# EAGLE design nrf_bridge (EAGLE 6.5.0)
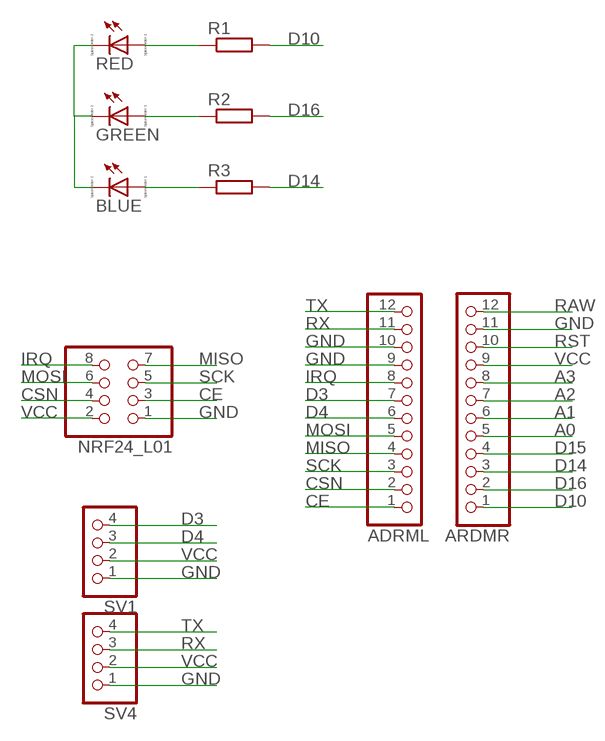
[diagram p0: schematic, sheet 1]

## Parts
ADRML  PINHD-1X12_2.54-SMD  [1X12SMD]
ARDMR  PINHD-1X12_2.54-SMD  [1X12SMD]
BLUE  LED_ESML0603  [LED_SML0603]
GREEN  LED_ESML0603  [LED_SML0603]
NRF24_L01  PINHD-2X4_2.54-SMD  [2X04SMD]
R1  R-EU_M0805  [M0805]
R2  R-EU_M0805  [M0805]
R3  R-EU_M0805  [M0805]
RED  LED_ESML0603  [LED_SML0603]
SV1  PINHD-1X4_2.54-SMD  [1X04SMD]
SV4  PINHD-1X4_2.54-SMD  [1X04SMD]

## Nets
A0: ARDMR.5
A1: ARDMR.6
A2: ARDMR.7
A3: ARDMR.8
CE: ADRML.1 NRF24_L01.3
CSN: ADRML.2 NRF24_L01.4
D3: ADRML.7 SV1.4
D4: ADRML.6 SV1.3
D10: ARDMR.1 R1.2
D14: ARDMR.3 R3.2
D15: ARDMR.4
D16: ARDMR.2 R2.2
GND: ADRML.9 ADRML.10 ARDMR.11 BLUE.C GREEN.C NRF24_L01.1 RED.C SV1.1 SV4.1
IRQ: ADRML.8 NRF24_L01.8
MISO: ADRML.4 NRF24_L01.7
MOSI: ADRML.5 NRF24_L01.6
N$1: BLUE.A R3.1
N$2: GREEN.A R2.1
N$3: R1.1 RED.A
RAW: ARDMR.12
RST: ARDMR.10
RX: ADRML.11 SV4.3
SCK: ADRML.3 NRF24_L01.5
TX: ADRML.12 SV4.4
VCC: ARDMR.9 NRF24_L01.2 SV1.2 SV4.2

## Library data of the parts
ADRML ARDMR = pinhead_smd:PINHD-1X12: PIN HEADER
BLUE GREEN RED = eagle-ltspice:LED_E: LED Source: http://www.osram.convergy.de Source: www.luxeon.com Source: www.kingbright.com; SPICEMODEL: NONE; SPICEPREFIX: D; SPICETYPE: diode
NRF24_L01 = pinhead_smd:PINHD-2X4: PIN HEADER
R1-R3 = resistor:R-EU_: RESISTOR, European symbol
SV1 SV4 = pinhead_smd:PINHD-1X4: PIN HEADER

## Board
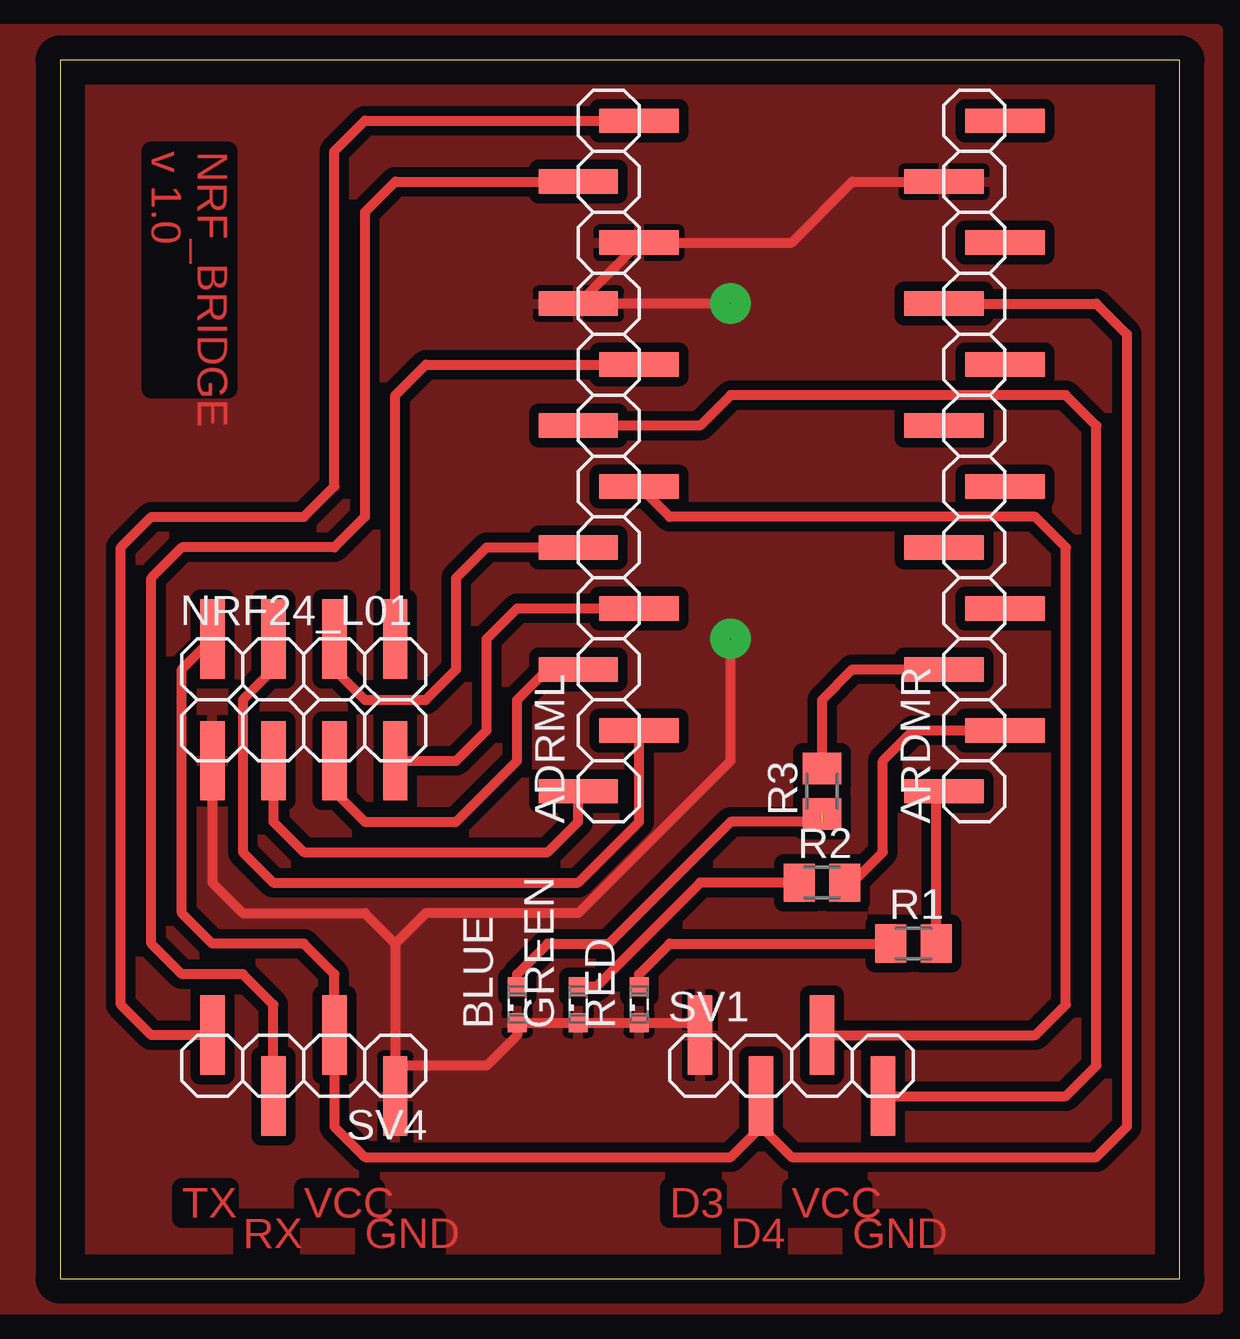
[diagram p1: board, top side]
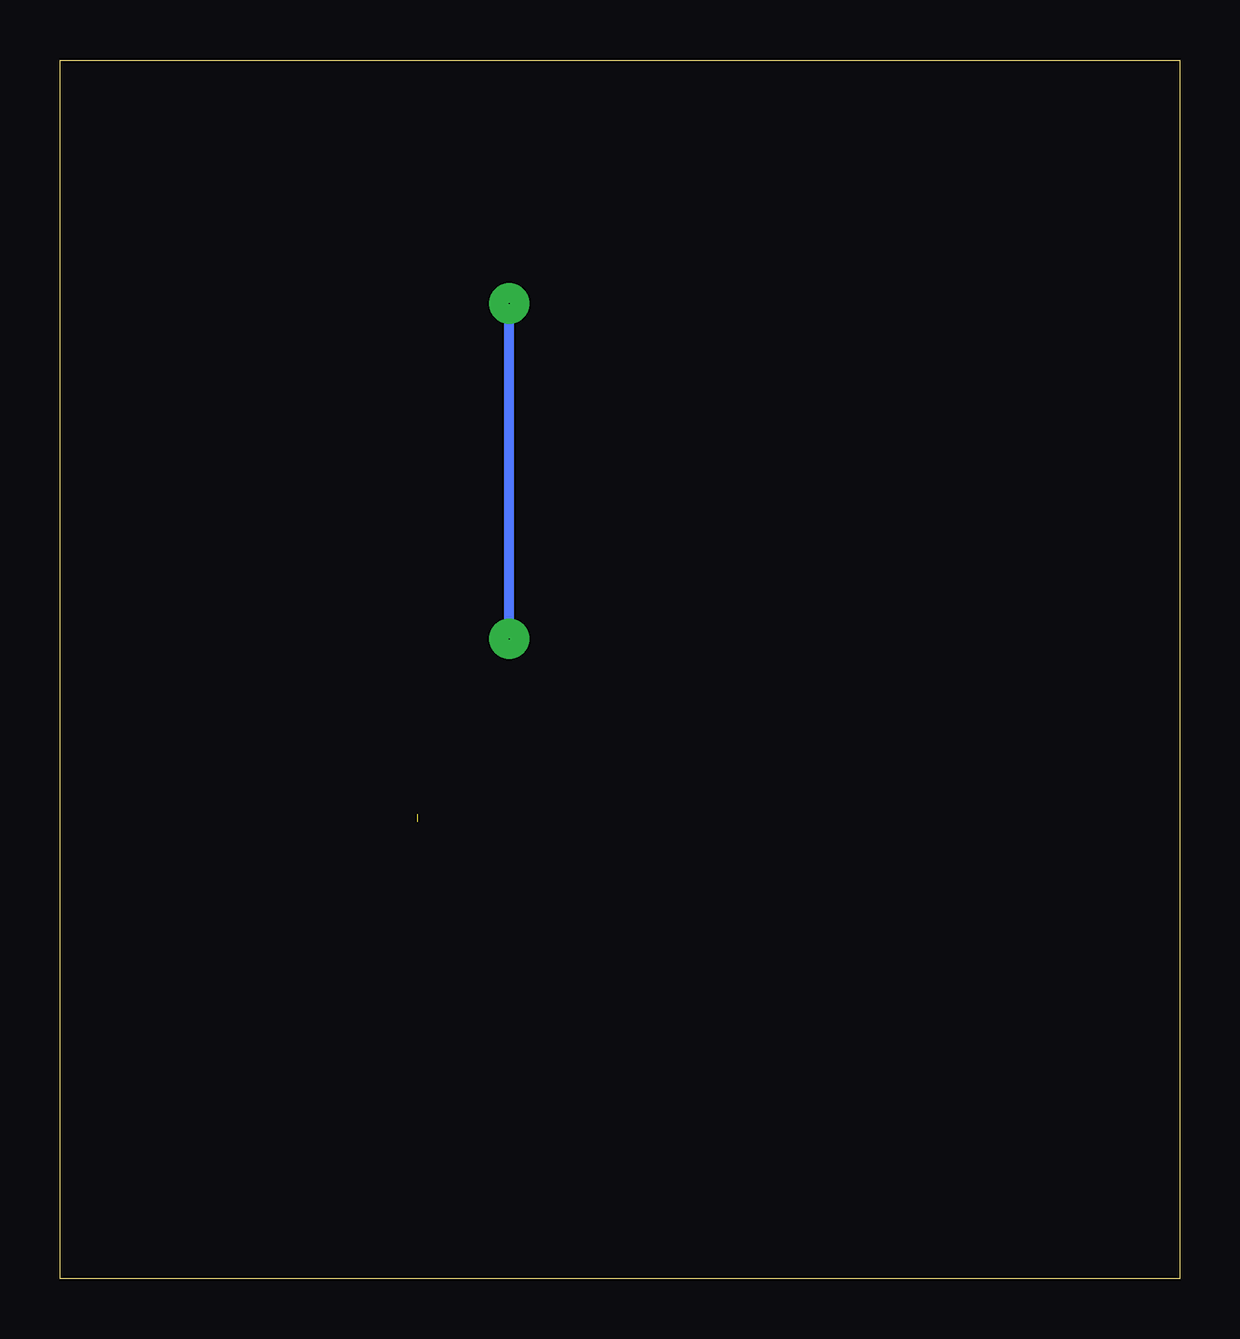
[diagram p2: board, bottom side, seen from below]

Size 46.66 x 50.79 mm. Coordinates in mm from the lower left corner, seen from the top.
Outline: 0,0 46.66,0 46.66,50.79 0,50.79 0,0
Copper layers (1*16): Top 0.035mm / dielectric 1.5mm / Bottom 0.035mm
Design rules "default": minimum track width 10mil, minimum drill 24mil, track to track 8mil, track to pad 8mil, pad to pad 8mil, via to via 8mil, smd to smd 8mil, copper to edge 40mil, drill to drill 8mil, minimum pad ring 10mil, minimum via ring 8mil, stop-mask expansion 4mil, vias tented up to drill 0mil, thermal gap 10mil

### Footprints (pad centres in the part's own frame; a part is rotated, then mirrored left to right if it is on the bottom)
1X12SMD = smd 1.016 x 3.302: 1 -1.27,1.27; 2 1.27,-1.27; 3 3.81,1.27; 4 6.35,-1.27; 5 8.89,1.27; 6 11.43,-1.27; 7 13.97,1.27; 8 16.51,-1.27; 9 19.05,1.27; 10 21.59,-1.27; 11 24.13,1.27; 12 26.67,-1.27
LED_SML0603 = smd 0.8 x 0.8: A 0.75,0; C -0.75,0
2X04SMD = smd 1.016 x 3.302: 1 -1.27,-3.81; 2 -1.27,1.27; 3 1.27,-3.81; 4 1.27,1.27; 5 3.81,-3.81; 6 3.81,1.27; 7 6.35,-3.81; 8 6.35,1.27
M0805 = smd 1.3 x 1.6: 1 -0.95,0; 2 0.95,0
1X04SMD = smd 1.016 x 3.302: 1 -1.27,1.27; 2 1.27,-1.27; 3 3.81,1.27; 4 6.35,-1.27

### Placement (x,y rotation side)
ADRML  22.86,21.59 90 top
ARDMR  38.1,21.59 90 top
BLUE  19.05,11.43 90 top
GREEN  21.59,11.43 90 top
NRF24_L01  7.62,25.4 0 top
R1  35.56,13.97 0 top
R2  31.75,16.51 0 top
R3  31.75,20.32 90 top
RED  24.13,11.43 90 top
SV1  27.94,8.89 0 top
SV4  12.7,8.89 180 top

### Tracks (layer width: path | path; a pad name or v marks a point on that pad's centre or on a via)
CE
  Top 0.406: NRF24_L01.3 8.89,19.05 10.16,17.78 20.32,17.78 21.59,19.05 ADRML.1
CSN
  Top 0.406: NRF24_L01.4 8.89,25.4 7.62,24.13 7.62,17.78 8.89,16.51 21.59,16.51 24.13,19.05 ADRML.2
D3
  Top 0.406: SV1.4 41.91,7.62 43.18,8.89 43.18,35.56 41.91,36.83 27.94,36.83 26.67,35.56 ADRML.7
D4
  Top 0.406: SV1.3 40.64,10.16 41.91,11.43 41.91,30.48 40.64,31.75 25.4,31.75 ADRML.6
D10
  Top 0.406: R1.2 36.51,20 ARDMR.1
D14
  Top 0.406: R3.2 31.75,24.13 33.02,25.4 ARDMR.3
D16
  Top 0.406: R2.2 33.02,16.51 34.29,17.78 34.29,21.59 35.56,22.86 ARDMR.2
GND  (via drill 0.03 pad 1.68)
  Top 0.406: NRF24_L01.1 6.35,16.51 7.62,15.24 12.7,15.24 13.97,13.97 | 13.97,13.97 13.97,8.89 | 13.97,8.89 SV4.1 | 13.97,13.97 15.24,15.24 21.59,15.24 27.94,21.59 v27.94,26.67 | BLUE.C GREEN.C | BLUE.C RED.C 26.15,10.68 SV1.1 | BLUE.C 19.05,10.16 17.78,8.89 13.97,8.89 | v27.94,40.64 ADRML.9 ADRML.10 30.48,43.18 33.02,45.72 ARDMR.11
  Bottom 0.406: v27.94,26.67 v27.94,40.64
  pour Top (isolate 0.406): -2.54,52.07 -2.54,-1.27 48.26,-1.27 48.26,3.81 48.26,52.07
IRQ
  Top 0.406: NRF24_L01.8 13.97,36.83 15.24,38.1 ADRML.8
MISO
  Top 0.406: NRF24_L01.7 16.51,21.59 17.78,22.86 17.78,26.67 19.05,27.94 ADRML.4
MOSI
  Top 0.406: NRF24_L01.6 11.43,25.4 12.7,24.13 15.24,24.13 16.51,25.4 16.51,29.21 17.78,30.48 ADRML.5
N$1  (1 unrouted)
  Top 0.406: 31.75,19.05 27.94,19.05 22.86,13.97 20.32,13.97 19.05,12.7 BLUE.A
N$2
  Top 0.406: R2.1 26.67,16.51 22.34,12.18 GREEN.A
N$3
  Top 0.406: 34.46,14.12 R1.1 25.4,13.97 24.13,12.7 RED.A
RX
  Top 0.406: SV4.3 8.89,11.43 7.62,12.7 5.08,12.7 3.81,13.97 3.81,29.21 5.08,30.48 11.43,30.48 12.7,31.75 12.7,44.45 13.97,45.72 ADRML.11
SCK
  Top 0.406: NRF24_L01.5 11.43,20.32 12.7,19.05 16.51,19.05 19.05,21.59 19.05,24.13 20.32,25.4 ADRML.3
TX
  Top 0.406: SV4.4 3.81,10.16 2.54,11.43 2.54,30.48 3.81,31.75 10.16,31.75 11.43,33.02 11.43,46.99 12.7,48.26 ADRML.12
VCC
  Top 0.406: NRF24_L01.2 5.08,25.4 5.08,15.24 6.35,13.97 10.16,13.97 11.43,12.7 SV4.2 11.43,6.35 12.7,5.08 27.94,5.08 29.21,6.35 | ARDMR.9 43.18,40.64 44.45,39.37 44.45,6.35 43.18,5.08 30.48,5.08 29.21,6.35 | SV1.2 29.21,6.35

### Text on the board
Top: NRF_BRIDGE / v 1.0 | TX | VCC | D3 | VCC | RX | GND | D4 | GND